# EAGLE design Dash LEDs (EAGLE 7.4.0)
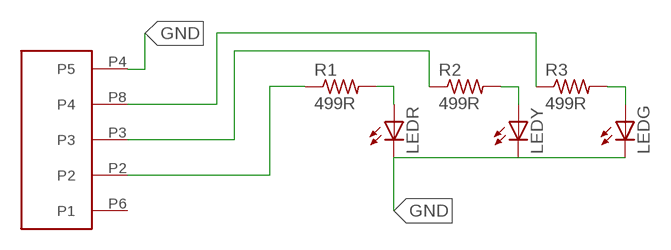
[diagram p0: schematic, sheet 1]

## Parts
LEDG  LED5MM  [LED5MM]
LEDR  LED5MM  [LED5MM]
LEDY  LED5MM  [LED5MM]
R1  499R  R-US_R0805  [R0805]
R2  499R  R-US_R0805  [R0805]
R3  499R  R-US_R0805  [R0805]
U$1  PICOLOCK  [PICOLOCK]

## Nets
DRV1: R1.1 U$1.P2
DRV2: R2.1 U$1.P3
DRV3: R3.1 U$1.P8(P4)
GND: LEDG.K(C) LEDR.K(C) LEDY.K(C) U$1.P4(P5)
N$1: LEDR.A R1.2
N$2: LEDY.A R2.2
N$3: LEDG.A R3.2
Unconnected: U$1.P6(P1)

## Library data of the parts
LEDG LEDR LEDY = led:LED: LED OSRAM: - CHIPLED LG R971, LG N971, LY N971, LG Q971, LY Q971, LO R971, LY R971 LH N974, LH R974 LS Q976, LO Q976, LY Q976 LO Q996 - Hyper CHIPLED LW Q18S LB Q993, LB Q99A, LB R99A - SideLED LS A670, LO A670, LY A670, LG A670, LP A670 LB A673, LV A673, LT A673, LW A673 LH A674 LY A675 LS A676, LA A676, LO A676, LY A676, LW A676 LS A679, LY A679, LG A679 - Hyper Micro SIDELED® LS Y876, LA Y876, LO Y876, LY Y876 LT Y87S - SmartLED LW L88C, LW L88S LB L89C, LB L89S, LG L890 LS L89K, LO L89K, LY L89K LS L896, LA L896, LO L896, LY L896 - TOPLED LS T670, LO T670, LY T670, LG T670, LP T670 LSG T670, LSP T670, LSY T670, LOP T670, LYG T670 LG T671, LOG T671, LSG T671 LB T673, LV T673, LT T673, LW T673 LH T674 LS T676, LA T676, LO T676, LY T676, LB T676, LH T676, LSB T676, LW T676 LB T67C, LV T67C, LT T67C, LS T67K, LO T67K, LY T67K, LW E67C LS E67B, LA E67B, LO E67B, LY E67B, LB E67C, LV E67C, LT E67C LW T67C LS T679, LY T679, LG T679 LS T770, LO T770, LY T770, LG T770, LP T770 LB T773, LV T773, LT T773, LW T773 LH T774 LS E675, LA E675, LY E675, LS T675 LS T776, LA T776, LO T776, LY T776, LB T776 LHGB T686 LT T68C, LB T68C - Hyper Mini TOPLED® LB M676 - Mini TOPLED Santana® LG M470 LS M47K, LO M47K, LY M47K Source: http://www.osram.convergy.de LUXEON: - LUMILED® LXK2-PW12-R00, LXK2-PW12-S00, LXK2-PW14-U00, LXK2-PW14-V00 LXK2-PM12-R00, LXK2-PM12-S00, LXK2-PM14-U00 LXK2-PE12-Q00, LXK2-PE12-R00, LXK2-PE12-S00, LXK2-PE14-T00, LXK2-PE14-U00 LXK2-PB12-K00, LXK2-PB12-L00, LXK2-PB12-M00, LXK2-PB14-N00, LXK2-PB14-P00, LXK2-PB14-Q00 LXK2-PR12-L00, LXK2-PR12-M00, LXK2-PR14-Q00, LXK2-PR14-R00 LXK2-PD12-Q00, LXK2-PD12-R00, LXK2-PD12-S00 LXK2-PH12-R00, LXK2-PH12-S00 LXK2-PL12-P00, LXK2-PL12-Q00, LXK2-PL12-R00 Source: www.luxeon.com KINGBRIGHT: KA-3528ASYC Source: www.kingbright.com
R1-R3 = resistor:R-US_: RESISTOR, American symbol
U$1 = DashAndCAN library:PICOLOCK

## Board
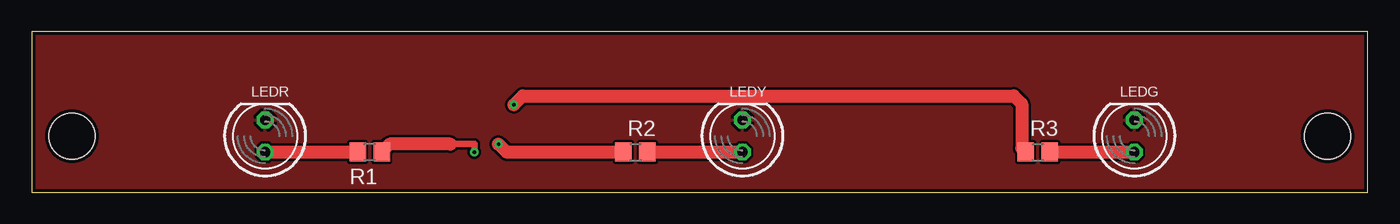
[diagram p1: board, top side]
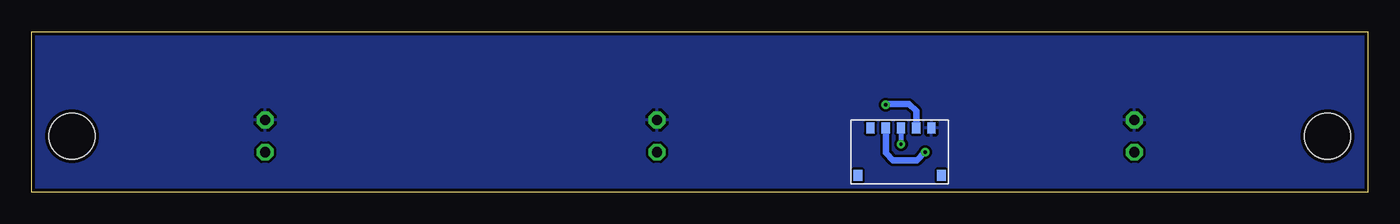
[diagram p2: board, bottom side, seen from below]

Size 105.41 x 12.7 mm. Coordinates in mm from the lower left corner, seen from the top.
Outline: 0,0 105.41,0 105.41,12.7 0,12.7 0,0
Copper layers (1*16): Top 0.035mm / dielectric 1.5mm / Bottom 0.035mm
Design rules "default *": minimum track width 7mil, minimum drill 10mil, track to track 8mil, track to pad 8mil, pad to pad 8mil, via to via 8mil, smd to smd 8mil, copper to edge 11mil, drill to drill 11mil, minimum pad ring 10mil, minimum via ring 8mil, stop-mask expansion 4mil, vias tented up to drill 0mil, thermal gap 10mil
Holes 3.66 mm at 3.17,4.45 102.23,4.45

### Footprints (pad centres in the part's own frame; a part is rotated, then mirrored left to right if it is on the bottom)
LED5MM = drill 0.813 octagon: A -1.27,0; K 1.27,0
R0805 = smd 1.3 x 1.5: 1 -0.95,0; 2 0.95,0
PICOLOCK = smd 0.7 x 0.85: P1 -3.4,-3.75; P5 3.2,-3.75 | smd 0.65 x 0.85: P2 -1.2,0; P3 0,0; P4 2.4,0; P6 -2.4,0; P8 1.2,0

### Placement (x,y rotation side)
LEDG  87,4.45 90 top
LEDR  18.41,4.45 90 top
LEDY  56.07,4.45 90 top
R1  26.67,3.17 180 top
R2  47.62,3.17 0 top
R3  79.38,3.17 0 top
U$1  36.83,5.08 0 bottom

### Tracks (layer width: path | path; a pad name or v marks a point on that pad's centre or on a via)
DRV1  (via drill 0.25 pad 0.51)
  Top 0.508: 33.02,3.81 34.92,3.81 v34.92,3.17
  Top 1.016: 33.02,3.81 28.25,3.81 R1.1
  Bottom 0.508: U$1.P2 38.03,3.1 37.47,2.54 35.56,2.54 v34.92,3.17
DRV2  (via drill 0.25 pad 0.51)
  Top 1.016: v36.83,3.81 37.47,3.17 R2.1
  Bottom 0.406: U$1.P3 v36.83,3.81
DRV3  (via drill 0.25 pad 0.51)
  Top 0.635: 78.11,3.5 R3.1
  Top 1.016: v38.03,6.92 38.73,7.62 77.47,7.62 78.11,6.99 78.11,3.5
  Bottom 0.508: U$1.P8 35.63,6.42 36.2,6.99 37.96,6.99 v38.03,6.92
GND
  pour Bottom: 0,0 0,12.7 105.41,12.7 105.41,0
  pour Top: 0,0 0,12.7 105.41,12.7 105.41,0
N$1
  Top 1.016: LEDR.A R1.2
N$2
  Top 1.016: R2.2 LEDY.A
N$3
  Top 1.016: R3.2 LEDG.A